# EAGLE design FeatherUSBSerial (EAGLE 9.2.2)
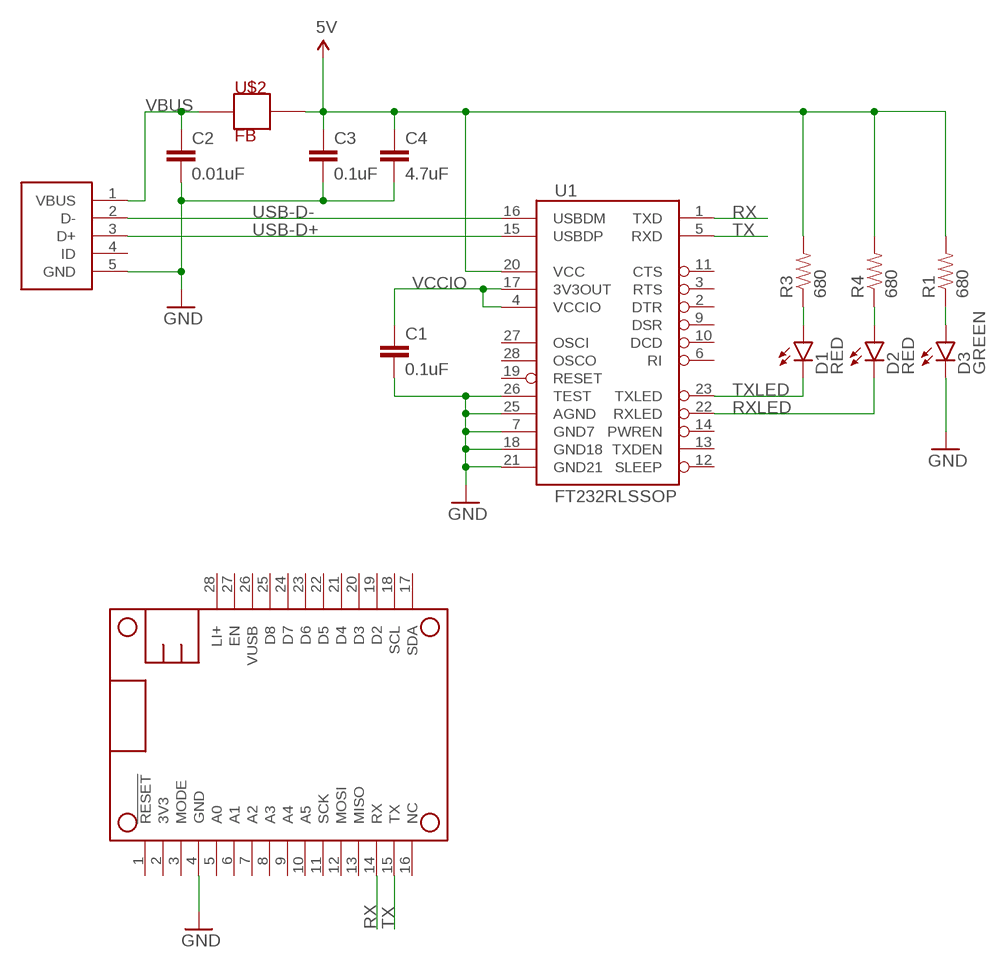
[diagram p0: schematic, sheet 1]

## Parts
C1  0.1uF  CAP-0.1UF-0603  [0603-CAP]
C2  0.01uF  CAP-0.01UF-0603  [0603-CAP]
C3  0.1uF  CAP-0.1UF-0603  [0603-CAP]
C4  4.7uF  CAP-4.7UF-0603  [0603-CAP]
D1  RED  LED-RED  [LED-0603]
D2  RED  LED-RED  [LED-0603]
D3  GREEN  LED-GREEN0603  [LED-0603]
MS1  FEATHERWING_NODIM  [FEATHERWING_NODIM]
R1  680  RES-680-0805  [0805]
R3  680  RES-680-0805  [0805]
R4  680  RES-680-0805  [0805]
U1  FT232RLSSOP  [SSOP28DB]
U$1  USB-MICRO-B-SOCKET-AMPHENOL  [USB-B-SMT-AMPHENOL]
U$2  FB  FERRITE-BEAD-MI0805K400R-10  [0805]

## Nets
5V: C3.1 C4.1 R1.2 R3.2 R4.2 U1.20(VCC) U$2.2
GND: C1.2 C2.2 C3.2 C4.2 D3.C MS1.4(GND) U1.7(GND7) U1.18(GND18) U1.21(GND21) U1.25(AGND) U1.26(TEST) U$1.5(GND)
N$5: D3.A R1.1
N$10: D1.A R3.1
N$11: D2.A R4.1
RX: MS1.14(RX) U1.1(TXD)
RXLED: D2.C U1.22(RXLED)
TX: MS1.15(TX) U1.5(RXD)
TXLED: D1.C U1.23(TXLED)
USB-D+: U1.15(USBDP) U$1.3(D+)
USB-D-: U1.16(USBDM) U$1.2(D-)
VBUS: C2.1 U$1.1(VBUS) U$2.1
VCCIO: C1.1 U1.4(VCCIO) U1.17(3V3OUT)
Unconnected: MS1.1(!RESET) MS1.2(3V3) MS1.3(MODE) MS1.5(A0) MS1.6(A1) MS1.7(A2) MS1.8(A3) MS1.9(A4) MS1.10(A5) MS1.11(SCK) MS1.12(MOSI) MS1.13(MISO) MS1.16(NC) MS1.17(SDA) MS1.18(SCL) MS1.19(D2) MS1.20(D3) MS1.21(D4) MS1.22(D5) MS1.23(D6) MS1.24(D7) MS1.25(D8) MS1.26(VUSB) MS1.27(EN) MS1.28(LI+) U1.2(DTR) U1.3(RTS) U1.6(RI) U1.9(DSR) U1.10(DCD) U1.11(CTS) U1.12(SLEEP) U1.13(TXDEN) U1.14(PWREN) U1.19(RESET) U1.27(OSCI) U1.28(OSCO) U$1.4(ID)

## Library data of the parts
C1 C3 = rickk2:CAP-0.1UF-0603: CAP CER 0.1UF 16V X7R 0603 https://www.digikey.com/product-detail/en/murata-electronics-north-america/GRM188R71C104KA01D/490-1532-1-ND/587771
C2 = rickk2:CAP-0.01UF-0603: CAP CER 10000PF 100V X7R 0603 10000 pF = 10 nF = 0.01 uF https://www.digikey.com/product-detail/en/murata-electronics-north-america/GCM188R72A103KA37J/490-8028-1-ND/4380313
C4 = rickk2:CAP-4.7UF-0603: Murata X5R series CAP CER 4.7UF 6.3V X5R 0603 $0.12 https://www.digikey.com/product-detail/en/murata-electronics-north-america/GRM188R60J475KE19J/490-6407-1-ND/3845604
D1 D2 = rickk2:LED-RED: LED RED CLEAR 0603 SMD $0.41 Red 631nm LED Indication - Discrete 2V 0603 (1608 Metric) 5mA@2V https://www.digikey.com/product-detail/en/lite-on-inc/LTST-C193KRKT-5A/160-1830-1-ND/2356251 Res = 270 ohm @ 3.3V Res = 680 ohm 1/8W @ 5V Res = 2.2K 1/8W @ 12V
D3 = rickk2:LED-GREEN: Lite-On LTST-C193KGKT-5A Green 572nm LED Indication - Discrete 2V 5 mA 0603 https://www.digikey.com/product-detail/en/lite-on-inc/LTST-C193KGKT-5A/160-1828-1-ND/2356247 Res = 270 ohm @ 3.3V, Res = 680 ohm 1/8W @ 5V
MS1 = Particle-Mesh:FEATHERWING
R1 R3 R4 = rickk2:RES-680-0805: RES SMD 680 OHM 5% 1/8W 0805 $0.10 Panasonic ERJ-6GEYJ681V ±5% 0.125W, 1/8W Chip Resistor 0805 (2012 Metric) Automotive AEC-Q200 Thick Film https://www.digikey.com/product-detail/en/panasonic-electronic-components/ERJ-6GEYJ681V/P680ACT-ND/90033
U1 = rickk2:FT232RL: USB UART FT232RL 4th Generation USB UART (USB <-> Serial) Controller. Spark Fun Electronics SKU : COM-00650 Production SKU IC-00870; PROD_ID: IC-00870
U$1 = rickk2:USB-MICRO-B-SOCKET-AMPHENOL: CONN USB MICRO B RECPT SMT R/A $0.42 Amphenol FCI 10118194-0001LF https://www.digikey.com/products/en?keywords=609-4618-1-nd
U$2 = rickk2:FERRITE-BEAD-MI0805K400R-10: Laird-Signal Integrity Products MI0805K400R-10 $2.93 for 25 FERRITE BEAD 40 OHM 0805 1LN https://www.digikey.com/products/en/filters/ferrite-beads-and-chips/841?k=MI0805K400R&k=&pkeyword=MI0805K400R&sv=0&pv7=2&pv1989=0&sf=0&quantity=&ColumnSort=0&page=1&pageSize=25

## Board
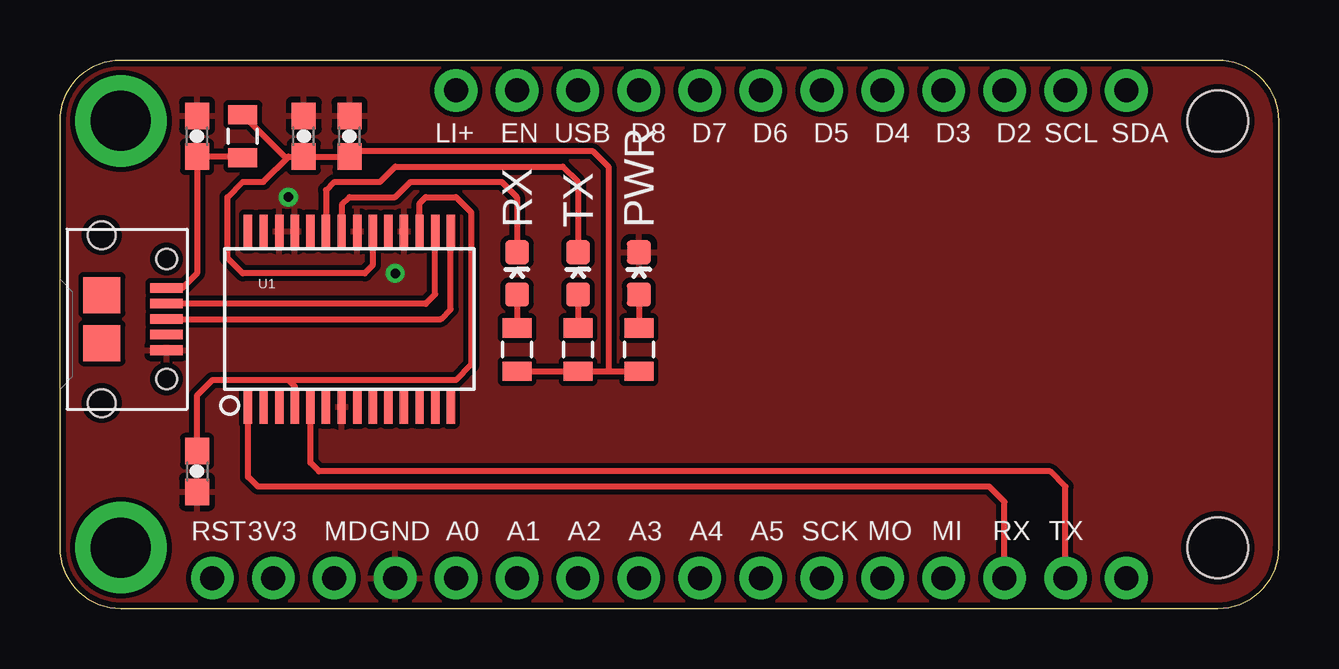
[diagram p1: board, top side]
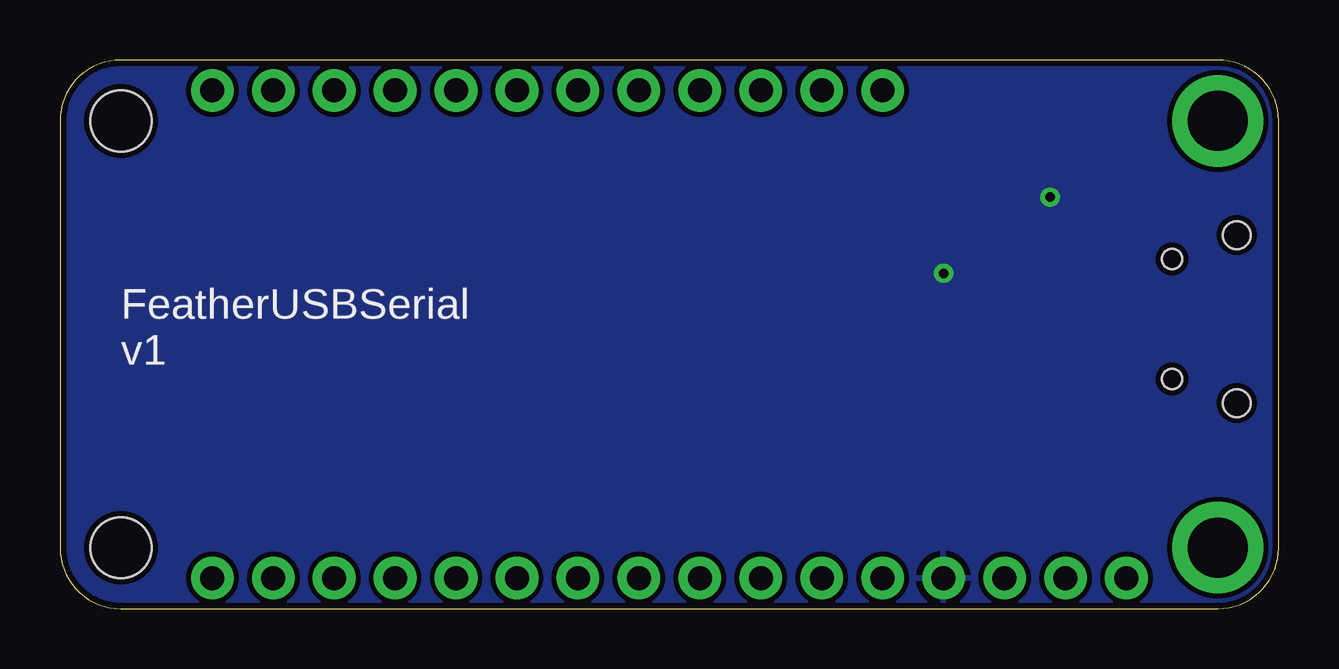
[diagram p2: board, bottom side, seen from below]

Size 50.8 x 22.86 mm. Coordinates in mm from the lower left corner, seen from the top.
Outline: 2.54,22.86 48.26,22.86 arc-90 50.8,20.32 50.8,2.54 arc-90 48.26,0 2.54,0 arc-90 0,2.54 0,20.32 arc-90 2.54,22.86
Copper layers (1*16): Top 0.035mm / dielectric 1.5mm / Bottom 0.035mm
Design rules "adafruit": minimum track width 8mil, minimum drill 15.5mil, track to track 8mil, track to pad 8mil, pad to pad 8mil, via to via 8mil, smd to smd 8mil, copper to edge 10mil, drill to drill 8mil, minimum pad ring 10mil, minimum via ring 8mil, stop-mask expansion 2mil, vias tented up to drill 20mil, thermal gap 10mil

### Footprints (pad centres in the part's own frame; a part is rotated, then mirrored left to right if it is on the bottom)
0603-CAP = smd 1.1 x 1: 1 -0.85,0; 2 0.85,0
LED-0603 = smd 1 x 1: A 0,-0.877; C 0,0.877
FEATHERWING_NODIM = drill 1 pad 1.778: 1 6.35,1.27; 2 8.89,1.27; 3 11.43,1.27; 4 13.97,1.27; 5 16.51,1.27; 6 19.05,1.27; 7 21.59,1.27; 8 24.13,1.27; 9 26.67,1.27; 10 29.21,1.27; 11 31.75,1.27; 12 34.29,1.27; 13 36.83,1.27; 14 39.37,1.27; 15 41.91,1.27; 16 44.45,1.27; 17 44.45,21.59; 18 41.91,21.59; 19 39.37,21.59; 20 36.83,21.59; 21 34.29,21.59; 22 31.75,21.59; 23 29.21,21.59; 24 26.67,21.59; 25 24.13,21.59; 26 21.59,21.59; 27 19.05,21.59; 28 16.51,21.59 | drill 2.5 pad 3.81: P$1 2.54,20.32; P$2 2.54,2.54 | hole 2.54: 48.26,20.32; 48.26,2.54
0805 = smd 0.8 x 1.2: 1 -0.9,0; 2 0.9,0
SSOP28DB = smd 0.348 x 1.397: 1 -4.225,-3.656; 2 -3.575,-3.656; 3 -2.925,-3.656; 4 -2.275,-3.656; 5 -1.625,-3.656; 6 -0.975,-3.656; 7 -0.325,-3.656; 8 0.325,-3.656; 9 0.975,-3.656; 10 1.625,-3.656; 11 2.275,-3.656; 12 2.925,-3.656; 13 3.575,-3.656; 14 4.225,-3.656; 15 4.225,3.656; 16 3.575,3.656; 17 2.925,3.656; 18 2.275,3.656; 19 1.625,3.656; 20 0.975,3.656; 21 0.325,3.656; 22 -0.325,3.656; 23 -0.975,3.656; 24 -1.625,3.656; 25 -2.275,3.656; 26 -2.925,3.656; 27 -3.575,3.656; 28 -4.225,3.656
USB-B-SMT-AMPHENOL = smd 0.4 x 1.35: 1 -1.3,0; 2 -0.65,0; 3 0,0; 4 0.65,0; 5 1.3,0 | smd 1.5 x 1.55: P$6 -1,-2.7; P$7 1,-2.7 | hole 0.85: -2.5,0; 2.5,0 | hole 1.15: -3.5,-2.7; 3.5,-2.7

### Placement (x,y rotation side)
C1  5.71,5.71 270 top
C2  5.71,19.68 90 top
C3  10.16,19.68 90 top
C4  12.06,19.68 90 top
D1  21.59,13.97 0 top
D2  19.05,13.97 0 top
D3  24.13,13.97 0 top
MS1  0,0 0 top
R1  24.13,10.79 270 top
R3  21.59,10.79 270 top
R4  19.05,10.79 270 top
U1  12.06,12.06 0 top
U$1  4.45,12.06 270 top
U$2  7.62,19.68 90 top

### Tracks (layer width: path | path; a pad name or v marks a point on that pad's centre or on a via)
5V
  Top 0.254: U$2.2 9.37,18.84 9.53,18.84 | 9.53,18.84 C3.1 C4.1 12.28,19.05 22.23,19.05 22.86,18.41 22.86,9.89 | U1.20 13.04,14.31 12.7,13.97 7.62,13.97 6.99,14.61 6.99,17.14 7.62,17.78 8.47,17.78 9.53,18.84 | R4.2 R3.2 22.86,9.89 | 22.86,9.89 R1.2
GND  (via drill 0.39)
  other vias: 9.53,17.14 13.97,13.97
  pour Top: 0,0 0,27.94 53.34,27.94 53.34,0
  pour Bottom: 0,0 0,30.48 55.88,30.48 55.88,0
N$5
  Top 0.254: D3.A R1.1
N$10
  Top 0.254: D1.A R3.1
N$11
  Top 0.254: D2.A R4.1
RX
  Top 0.254: MS1.14 39.37,4.45 38.73,5.08 15.24,5.08 13.97,5.08 8.26,5.08 7.84,5.5 U1.1
RXLED
  Top 0.254: U1.22 11.74,16.82 12.06,17.14 13.97,17.14 14.61,17.78 18.41,17.78 19.05,17.14 D2.C
TX
  Top 0.254: MS1.15 41.91,5.08 41.27,5.71 10.79,5.71 10.44,6.07 U1.5
TXLED
  Top 0.254: U1.23 11.09,17.44 11.43,17.78 13.34,17.78 13.97,18.41 20.95,18.41 21.59,17.78 D1.C
USB-D+
  Top 0.254: U$1.3 15.88,12.06 16.29,12.48 U1.15
USB-D-
  Top 0.254: U$1.2 15.22,12.71 15.24,12.7 15.64,13.1 U1.16
VBUS
  Top 0.254: U$2.1 7.57,18.84 C2.1 5.71,13.97 5.11,13.37 U$1.1
VCCIO
  Top 0.254: C1.1 5.71,8.89 6.35,9.53 9.53,9.53 | U1.17 14.99,16.89 15.24,17.14 16.51,17.14 17.14,16.51 17.14,10.16 16.51,9.53 9.53,9.53 | U1.4 9.79,9.26 9.53,9.53

### Text on the board
tPlace: LI+ | EN | USB | D8 | D7 | D6 | D5 | D4 | D3 | D2 | SCL | SDA | RX | TX | PWR | RST | 3V3 | MD | GND | A0 | A1 | A2 | A3 | A4 | A5 | SCK | MO | MI | RX | TX
bPlace: FeatherUSBSerial / v1
Document: 10nF | FB | 0.1uF | 4.7uF | RED | RED | GREEN | FT232RL | 680 | 680 | 680 | 0.1uF